# Altium schematic sheet Controllable_voltage_outputs.SchDoc
size A4; SheetNumber: 3; SheetTotal: 10
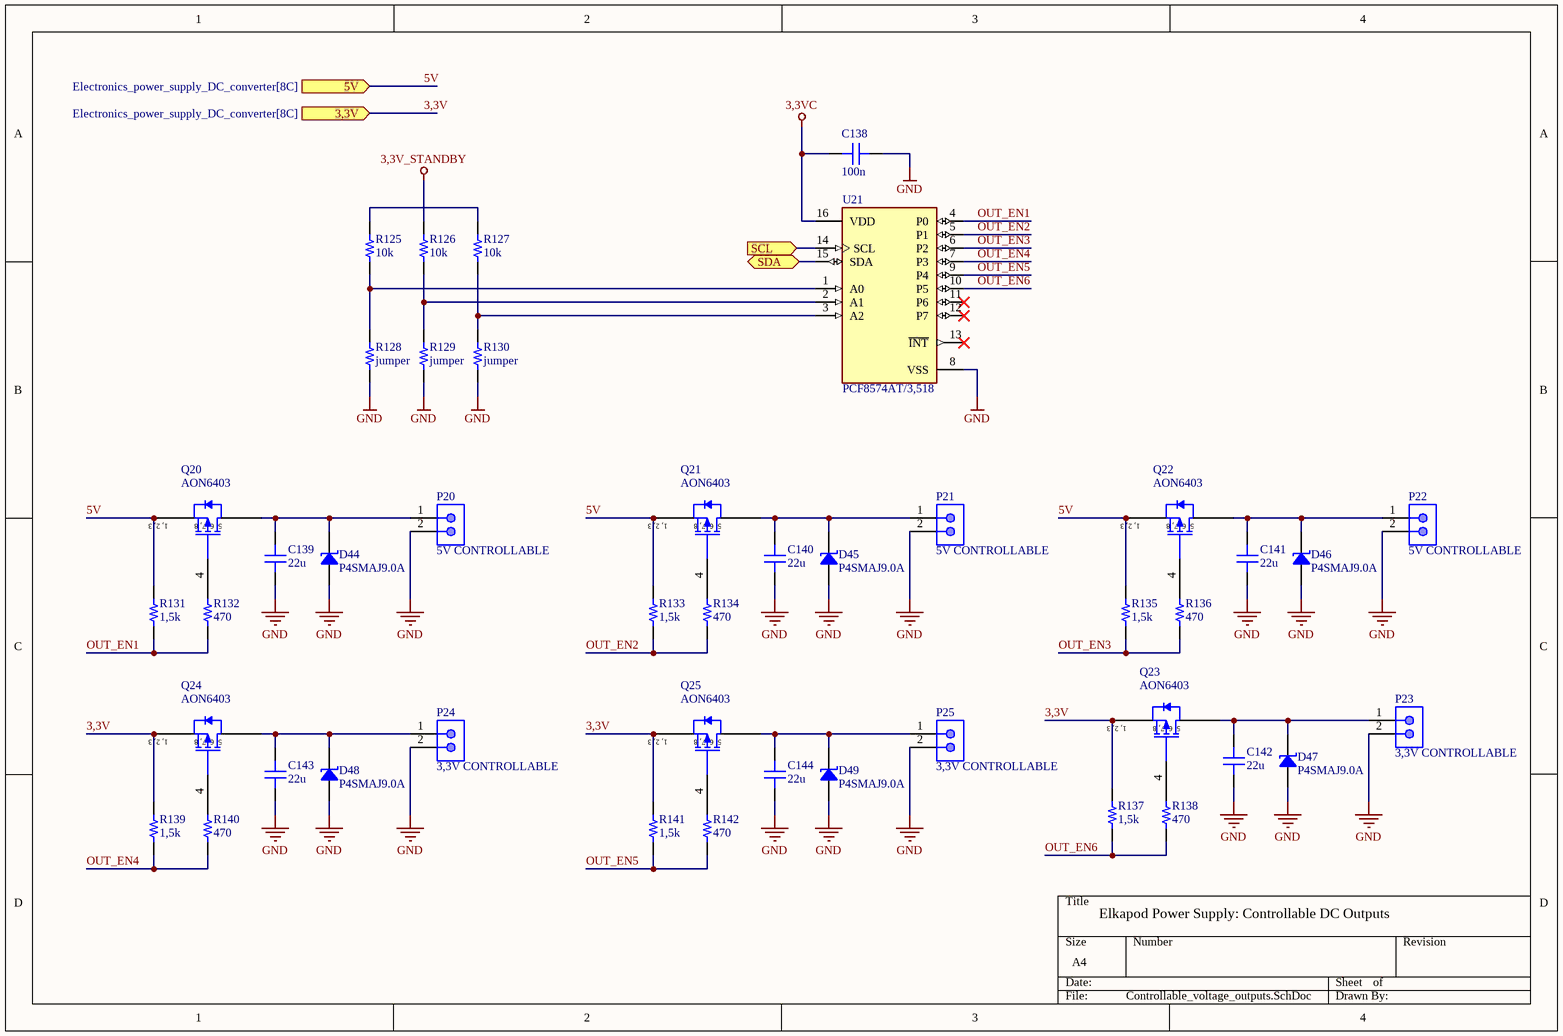
[diagram p0: Controllable_voltage_outputs.SchDoc]

## Parts
C138  100n  [CAP 0603_1608]
C139  22u  [CAP 0805_2012]
C140  22u  [CAP 0805_2012]
C141  22u  [CAP 0805_2012]
C142  22u  [CAP 0805_2012]
C143  22u  [CAP 0805_2012]
C144  22u  [CAP 0805_2012]
D44  P4SMAJ9.0A  [DO214AC SMA]
D45  P4SMAJ9.0A  [DO214AC SMA]
D46  P4SMAJ9.0A  [DO214AC SMA]
D47  P4SMAJ9.0A  [DO214AC SMA]
D48  P4SMAJ9.0A  [DO214AC SMA]
D49  P4SMAJ9.0A  [DO214AC SMA]
P20  5V CONTROLLABLE  [MOLX-22-23-2021_V]
P21  5V CONTROLLABLE  [MOLX-22-23-2021_V]
P22  5V CONTROLLABLE  [MOLX-22-23-2021_V]
P23  3,3V CONTROLLABLE  [MOLX-22-23-2021_V]
P24  3,3V CONTROLLABLE  [MOLX-22-23-2021_V]
P25  3,3V CONTROLLABLE  [MOLX-22-23-2021_V]
Q20  AON6403  [DFN5x6]
Q21  AON6403  [DFN5x6]
Q22  AON6403  [DFN5x6]
Q23  AON6403  [DFN5x6]
Q24  AON6403  [DFN5x6]
Q25  AON6403  [DFN5x6]
R125  10k  [RES 0603_1608]
R126  10k  [RES 0603_1608]
R127  10k  [RES 0603_1608]
R128  value jumper  [RES 0603_1608]  (hidden comment: A0_jumper)
R129  value jumper  [RES 0603_1608]  (hidden comment: A1_jumper)
R130  value jumper  [RES 0603_1608]  (hidden comment: A2_jumper)
R131  1,5k  [RES 0603_1608]
R132  470  [RES 0603_1608]
R133  1,5k  [RES 0603_1608]
R134  470  [RES 0603_1608]
R135  1,5k  [RES 0603_1608]
R136  470  [RES 0603_1608]
R137  1,5k  [RES 0603_1608]
R138  470  [RES 0603_1608]
R139  1,5k  [RES 0603_1608]
R140  470  [RES 0603_1608]
R141  1,5k  [RES 0603_1608]
R142  470  [RES 0603_1608]
U21  PCF8574AT/3,518  [FP-SOT162-1-MFG]

## Ports
3,3V (in, see Electronics_power_supply_DC_converter[8C]), 5V (in, see Electronics_power_supply_DC_converter[8C]), SCL (in, see Electronics_power_supply_DC_converter[8C], Electronics_power_supply_DC_converter[7C], Logic_controller[1D], Servos_controller[1C], Servos_DC_converter[5A]), SDA (bidir, see Electronics_power_supply_DC_converter[8C], Electronics_power_supply_DC_converter[7C], Logic_controller[1D], Servos_controller[1C], Servos_DC_converter[5A])

## Nets
3,3V_STANDBY: R126.1
3,3VC: C138.2 U21.16(VDD)
GND: C138.1 C139.1 C140.1 C141.1 C142.1 C143.1 C144.1 D44.1 D45.1 D46.1 D47.1 D48.1 D49.1 P20.2 P21.2 P22.2 P23.2 P24.2 P25.2 R128.2 R129.2 R130.2 U21.8(VSS)
3,3V: Q23.1(S) Q23.2(S) Q23.3(S) Q24.1(S) Q24.2(S) Q24.3(S) Q25.1(S) Q25.2(S) Q25.3(S) R137.1 R139.1 R141.1 ; port 3,3V
5V: Q20.1(S) Q20.2(S) Q20.3(S) Q21.1(S) Q21.2(S) Q21.3(S) Q22.1(S) Q22.2(S) Q22.3(S) R131.1 R133.1 R135.1 ; port 5V
OUT_EN1: R131.2 R132.2 U21.4(P0)
OUT_EN2: R133.2 R134.2 U21.5(P1)
OUT_EN3: R135.2 R136.2 U21.6(P2)
OUT_EN4: R139.2 R140.2 U21.7(P3)
OUT_EN5: R141.2 R142.2 U21.9(P4)
OUT_EN6: R137.2 R138.2 U21.10(P5)
SCL: U21.14(SCL) ; port SCL
SDA: U21.15(SDA) ; port SDA
NetC139_2: C139.2 D44.2 P20.1 Q20.5-6-7-8(D)
NetC140_2: C140.2 D45.2 P21.1 Q21.5-6-7-8(D)
NetC141_2: C141.2 D46.2 P22.1 Q22.5-6-7-8(D)
NetC142_2: C142.2 D47.2 P23.1 Q23.5-6-7-8(D)
NetC143_2: C143.2 D48.2 P24.1 Q24.5-6-7-8(D)
NetC144_2: C144.2 D49.2 P25.1 Q25.5-6-7-8(D)
NetQ20_4: Q20.4(G) R132.1
NetQ21_4: Q21.4(G) R134.1
NetQ22_4: Q22.4(G) R136.1
NetQ23_4: Q23.4(G) R138.1
NetQ24_4: Q24.4(G) R140.1
NetQ25_4: Q25.4(G) R142.1
NetR125_1: R125.1 R127.1
NetR125_2: R125.2 R128.1 U21.1(A0)
NetR126_2: R126.2 R129.1 U21.2(A1)
NetR127_2: R127.2 R130.1 U21.3(A2)

Not connected (* = marked no-connect by the designer): U21 11(P6)* 12(P7)* 13(~{INT})*

## Notes on the sheet
- Elkapod Power Supply: Controllable DC Outputs
- (in symbol AON6403) 1, 2, 3; 5, 6, 7, 8

## Library data of the parts
C138 = C0603C272F3GAC7867: CAP CER 100nF 25V X5R 0603; manufacturer: KEMET; Temperature Coefficient: C0G, NP0; Tolerance: ±1%; Part Number: C0603C272F3GAC7867; Value: 100n; Applications: General Purpose; Capacitance: 100n; componentlink1description: Datasheet; componentlink1url: https://api.kemet.com/component-edge/download/datasheet/C0603C272F3GACTU.pdf; componentlink2description: DigiKey Link; componentlink2url: https://www.digikey.com/en/products/detail/kemet/C0603C272F3GAC7867/2200413; Device Package: 0603 (1608 Metric); Features: Low ESL; lastupdated: 09.02.2024 20:10:30; Lifecycle Status: Active; Minimum Order: 1; Mounting Type: Surface Mount, MLCC; Operating Temperature: -55°C ~ 125°C; Package / Case: 0603 (1608 Metric); packaging: TapeAndReel; partid: 2138; Part Status: Active; price: 0.40; series: SMD Comm C0G; Size / Dimension: 0.063" L x 0.031" W (1.60mm x 0.80mm); Thickness (Max): 0.034" (0.87mm); Voltage - Rated: 25V
C139-C144 = VJ0805Y684KXQTW1BC: CAP CER 22UF 25V X7R 0805; manufacturer: Vishay Vitramon; Tolerance: ±10%; Voltage - Rated: 10V; Part Number: VJ0805Y684KXQTW1BC; Value: 22u; Applications: General Purpose; Capacitance: 22u; componentlink1description: Datasheet; componentlink1url: https://www.vishay.com/docs/28548/vjw1bcbascomseries.pdf; componentlink2description: DigiKey Link; componentlink2url: https://www.digikey.com/en/products/detail/vishay-vitramon/VJ0805Y684KXQTW1BC/8313569; Device Package: 0805 (2012 Metric); lastupdated: 09.02.2024 20:13:13; Lifecycle Status: Active; Minimum Order: 1; Mounting Type: Surface Mount, MLCC; Operating Temperature: -55°C ~ 125°C; Package / Case: 0805 (2012 Metric); packaging: TapeAndReel; partid: 57262; price: 0.05; series: VJ W1BC; Size / Dimension: 0.079" L x 0.049" W (2.00mm x 1.25mm); Temperature Coefficient: X7R; Thickness (Max): 0.053" (1.35mm)
D44-D49 = SMA6J18A-TP: TVS DIODE 9VDC DO214AC; Part Number: P4SMAJ9.0A
P20-P25 = CMP-1704-00001-3: Male Header, Pitch 2.54 mm, 1 x 2 Position, Height 10.67 mm, Tail Length 3.56 mm, 0 to 75 degC, RoHS, Bulk; Package Quantity: 3000; Height: 10.67 mm; RoHSCompliant: True; ComponentLink2URL: https://datasheet.ciiva.com/19454/232266-19454304.pdf; PartNumber: 22-23-2021; Packaging: Bulk; ComponentLink2Description: Datasheet; Min Operating Temperature: 0 degC; ComponentLink1Description: Manufacturer URL; Length: 5.08 mm; Mounting Technology: Through Hole; Max Operating Temperature: 75 degC; REACH SVHC: Unknown; PackageDescription: Male Header, Pitch 2.54 mm, 1 x 2 Position, Height 10.67 mm, Tail Length 3.56 mm; ComponentLink1URL: http://www.molex.com/; Mount: Through Hole; Radiation Hardening: No; Width: 6.35 mm; Pins: 2
Q20-Q25 = AON6403: P-MOSFET; 67A; 30V; DFN5x6
R125-R127 = RNCS0603BKE10K0: RES 10K OHM 1% 0,1W 0603; Manufacturer: Stackpole Electronics Inc; Power (Watts): 0.063W, 1/16W; Temperature Coefficient: ±25ppm/°C; Tolerance: ±0.1%; Part Number: RNCS0603BKE10K0; Value: 10k; Composition: Thin Film; Device Package: 0603 (1608 Metric); Features: Anti-Corrosive, Automotive AEC-Q200, Moisture Resistant; Height - Seated (Max): 0.022" (0.55mm); LastUpdated: 09.02.2024 20:43:37; Lifecycle Status: Active; Minimum Order: 1; Number of Terminations: 2; Operating Temperature: -55°C ~ 155°C; Package / Case: 0603 (1608 Metric); Packaging: TapeAndReel; PartId: 4838; Part Status: Active; Price: 0.06; Ratings: AEC-Q200; Resistance: 10k; Series: RNCS; Size / Dimension: 0.061" L x 0.031" W (1.55mm x 0.80mm); Supplier Device Package: 0603
R128-R130 = RNCS0603BKE10K0: RES 0 OHM 1% 0,1W 0603; Manufacturer: Stackpole Electronics Inc; Power (Watts): 0.063W, 1/16W; Resistance: 0; Temperature Coefficient: ±25ppm/°C; Tolerance: ±0.1%; Part Number: RNCS0603BKE10K0; Composition: Thin Film; Device Package: 0603 (1608 Metric); Features: Anti-Corrosive, Automotive AEC-Q200, Moisture Resistant; Height - Seated (Max): 0.022" (0.55mm); LastUpdated: 09.02.2024 20:43:37; Lifecycle Status: Active; Minimum Order: 1; Number of Terminations: 2; Operating Temperature: -55°C ~ 155°C; Package / Case: 0603 (1608 Metric); Packaging: TapeAndReel; PartId: 4838; Part Status: Active; Price: 0.06; Ratings: AEC-Q200; Series: RNCS; Size / Dimension: 0.061" L x 0.031" W (1.55mm x 0.80mm); Supplier Device Package: 0603
R131 R133 R135 R137 R139 R141 = RNCS0603BKE10K0: RES 1,5K OHM 1% 0,1W 0603; Manufacturer: Stackpole Electronics Inc; Power (Watts): 0.063W, 1/16W; Temperature Coefficient: ±25ppm/°C; Tolerance: ±0.1%; Part Number: RNCS0603BKE10K0; Value: 1,5k; Composition: Thin Film; Device Package: 0603 (1608 Metric); Features: Anti-Corrosive, Automotive AEC-Q200, Moisture Resistant; Height - Seated (Max): 0.022" (0.55mm); LastUpdated: 09.02.2024 20:43:37; Lifecycle Status: Active; Minimum Order: 1; Number of Terminations: 2; Operating Temperature: -55°C ~ 155°C; Package / Case: 0603 (1608 Metric); Packaging: TapeAndReel; PartId: 4838; Part Status: Active; Price: 0.06; Ratings: AEC-Q200; Resistance: 1,5k; Series: RNCS; Size / Dimension: 0.061" L x 0.031" W (1.55mm x 0.80mm); Supplier Device Package: 0603
R132 R134 R136 R138 R140 R142 = RNCS0603BKE10K0: RES 470 OHM 1% 0,1W 0603; Manufacturer: Stackpole Electronics Inc; Power (Watts): 0.063W, 1/16W; Temperature Coefficient: ±25ppm/°C; Tolerance: ±0.1%; Part Number: RNCS0603BKE10K0; Value: 470; Composition: Thin Film; Device Package: 0603 (1608 Metric); Features: Anti-Corrosive, Automotive AEC-Q200, Moisture Resistant; Height - Seated (Max): 0.022" (0.55mm); LastUpdated: 09.02.2024 20:43:37; Lifecycle Status: Active; Minimum Order: 1; Number of Terminations: 2; Operating Temperature: -55°C ~ 155°C; Package / Case: 0603 (1608 Metric); Packaging: TapeAndReel; PartId: 4838; Part Status: Active; Price: 0.06; Ratings: AEC-Q200; Resistance: 470; Series: RNCS; Size / Dimension: 0.061" L x 0.031" W (1.55mm x 0.80mm); Supplier Device Package: 0603
U21 = CMP-10112-000003-1: IC I/O EXPANDER I2C 8B 16SOIC; Manufacturer: NXP Semiconductors; Interface: I2C,SMBus; Frequency: 100kHz; Nominal Supply Current: 40uA; Max Supply Voltage: 6V; Number Of I/Os: 8; Max Junction Temp: +125°C; Min Supply Voltage: 2.5V; Standoff Height: 0.1mm; RoHS: TRUE; Category: IC; Temperature: -40°C to +85°C; Device Class L3: I/O Expanders; ComponentLink2Description: Datasheet; ComponentLink2URL: https://www.nxp.com/docs/en/data-sheet/PCF8574_PCF8574A.pdf; Digikey Description: IC I/O EXPANDER I2C 8B 16SOIC; Ipc Land Pattern Name: SOIC127P1032X265-16; Mouser Description: PCF8574 Series 2.5 to 6V Remote 8-bit I/O Expander for I2C-bus -SOIC-16; Footprint Url: https://www.nxp.com/docs/en/package-information/SOT162-1.pdf; Lead Free: Yes; Device Class L2: Interface ICs; Ambient Temperature Range Low: -40°C; Temperature Range High: +85°C; Automotive: No; Manufacturer Part Number: PCF8574AT/3,518; Ambient Temperature Range High: +85°C; Height: 2.65mm; Package: SOT162-1; Temperature Range Low: -40°C; Octopart: https://octopart.com/pcf8574at%2F3%2C518-nxp+semiconductors-11541925; Device Class L1: Integrated Circuits (ICs)